# EAGLE design iv4_4lw_1.2.1usb (EAGLE 5.06)
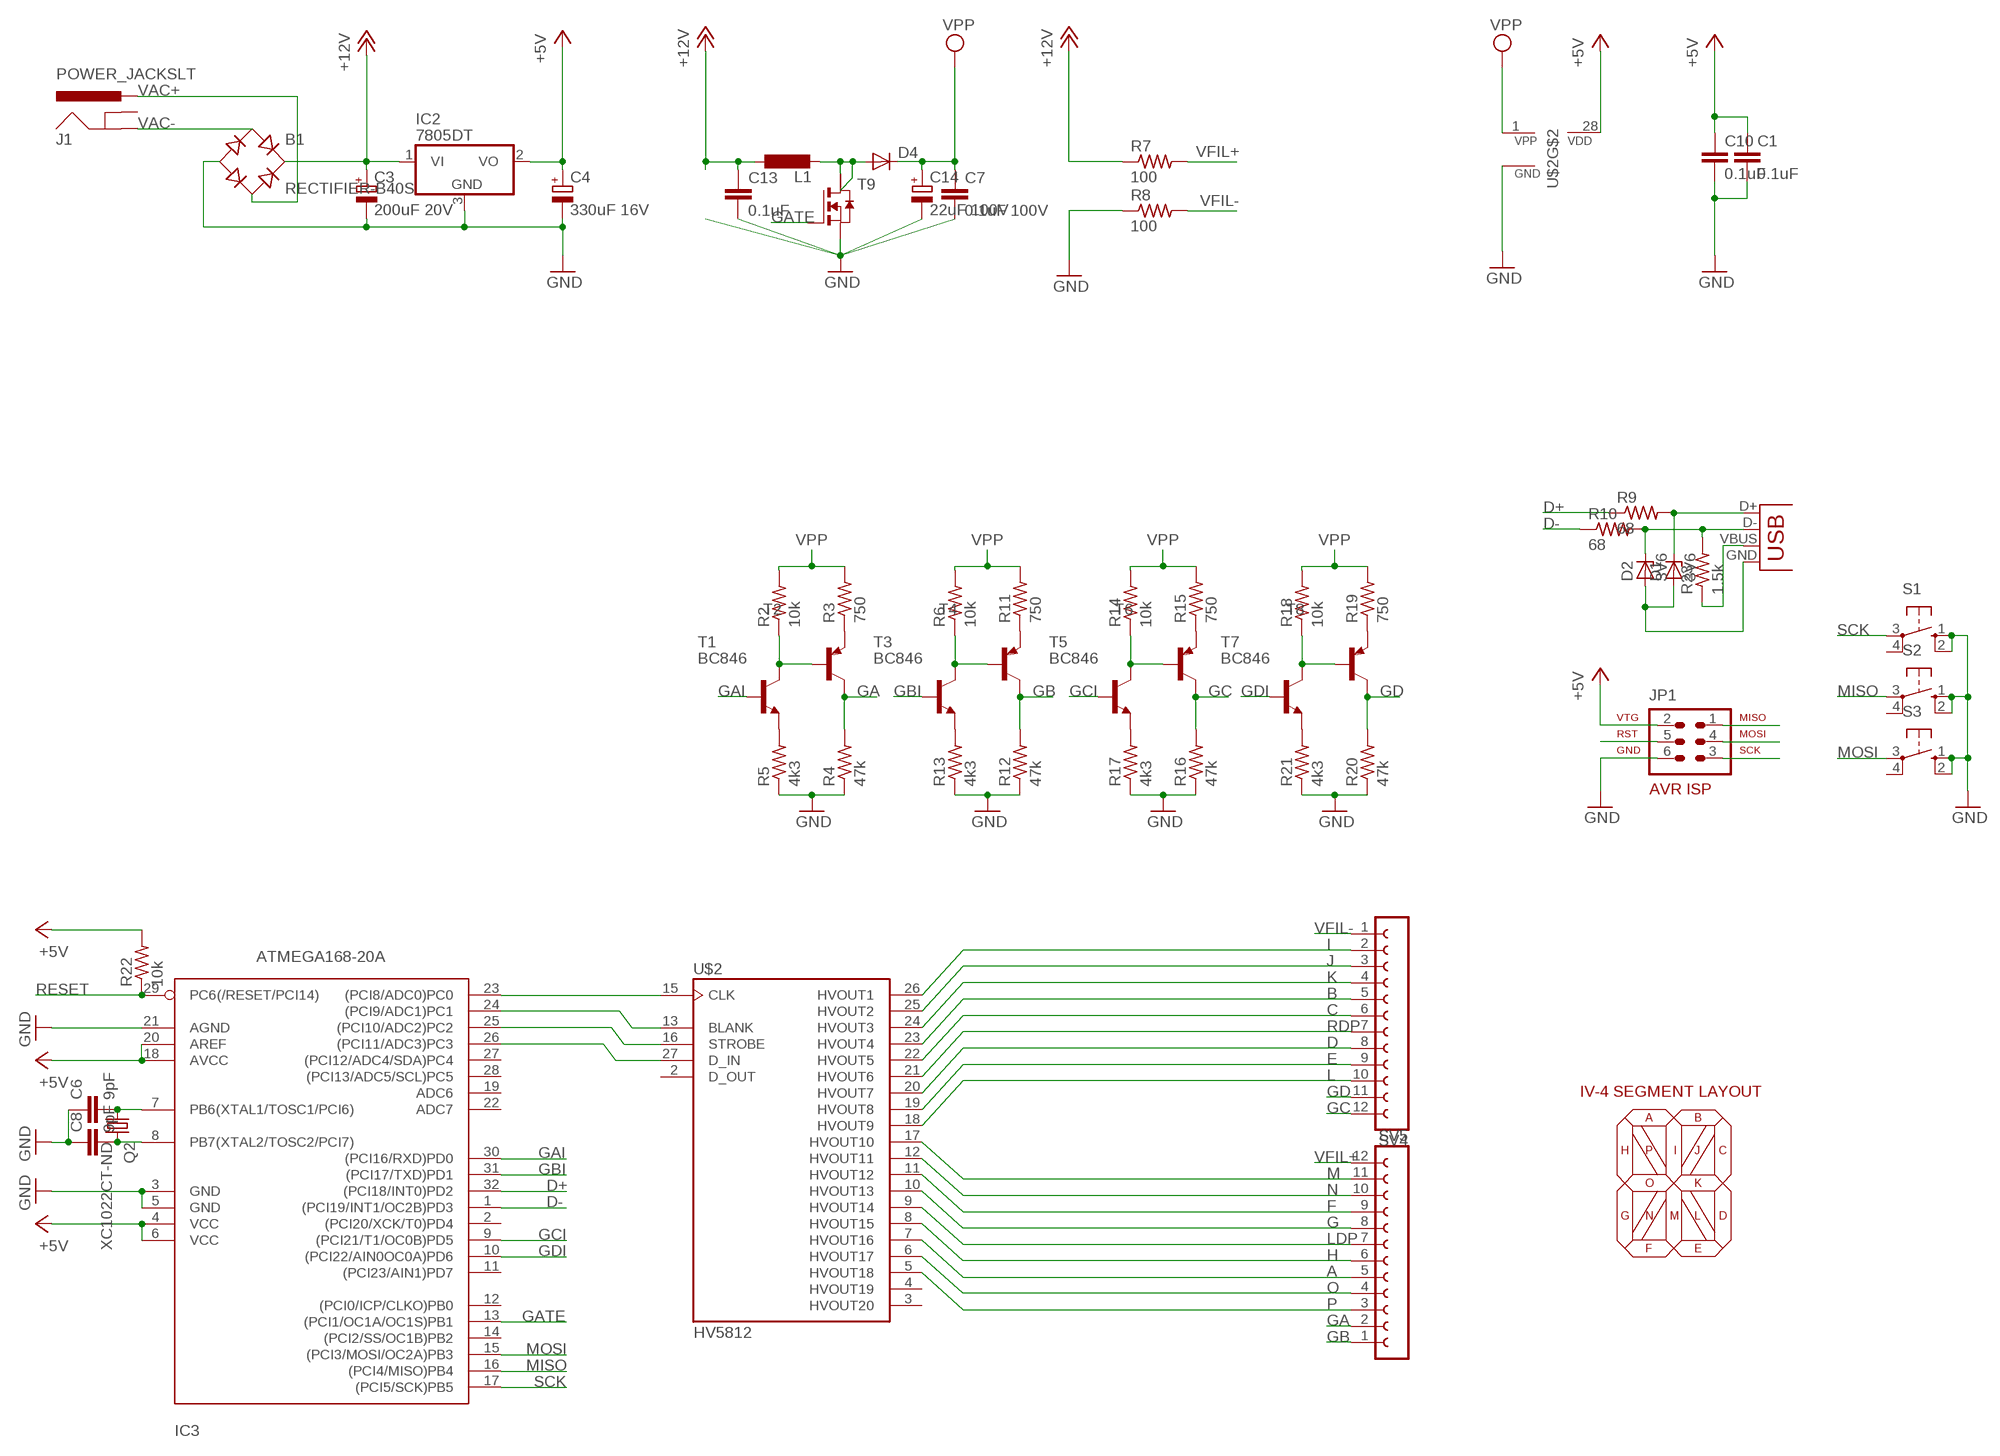
[diagram p0: schematic, sheet 1]

## Parts
B1  RECTIFIER-B40S  [B40S]
C1  0.1uF  C-EUC0805  [C0805]
C3  200uF 20V  CPOL-EUE2.5-7  [E2,5-7]
C4  330uF 16V  CPOL-EUE2.5-7  [E2,5-7]
C6  9pF  C-EUC0805  [C0805]
C7  0.1uF 100V  C-EUC1206  [C1206]
C8  9pF  C-EUC0805  [C0805]
C10  0.1uF  C-EUC0805  [C0805]
C13  0.1uF  C-EUC0805  [C0805]
C14  22uF 100V  CPOL-EUE2.5-7  [E2,5-7]
D1  3V6  ZENER-DIODESOD80C  [SOD80C]
D2  3V6  ZENER-DIODESOD80C  [SOD80C]
D4  DIODE-DO214AC  [DO214AC]
IC2  7805DT  [TO252]
IC3  ATMEGA168-20A  [TQFP32-08]
J1  POWER_JACKSLT  [POWER_JACK_SLOT]
JP1  AVR-ISP-6  [AVR-ISP-6]
L1  DO3316P  [DO3316P]
Q2  XC1022CT-ND  CRYSTALCTS406  [CTS406]
R2  10k  R-US_R0805  [R0805]
R3  750  R-US_R0805  [R0805]
R4  47k  R-US_R0805  [R0805]
R5  4k3  R-US_R0805  [R0805]
R6  10k  R-US_R0805  [R0805]
R7  100  R-US_0207/7  [0207/7]
R8  100  R-US_0207/7  [0207/7]
R9  68  R-US_R0805  [R0805]
R10  68  R-US_R0805  [R0805]
R11  750  R-US_R0805  [R0805]
R12  47k  R-US_R0805  [R0805]
R13  4k3  R-US_R0805  [R0805]
R14  10k  R-US_R0805  [R0805]
R15  750  R-US_R0805  [R0805]
R16  47k  R-US_R0805  [R0805]
R17  4k3  R-US_R0805  [R0805]
R18  10k  R-US_R0805  [R0805]
R19  750  R-US_R0805  [R0805]
R20  47k  R-US_R0805  [R0805]
R21  4k3  R-US_R0805  [R0805]
R22  10k  R-US_R0805  [R0805]
R23  1.5k  R-US_R0805  [R0805]
S1  10-XX  [B3F-10XX]
S2  10-XX  [B3F-10XX]
S3  10-XX  [B3F-10XX]
SV4  FE12-1  [FE12]
SV5  FE12-1  [FE12]
T1  BC846  [SOT23]
T2  BC856A-PNP-SOT23-BEC  [SOT23-BEC]
T3  BC846  [SOT23]
T4  BC856A-PNP-SOT23-BEC  [SOT23-BEC]
T5  BC846  [SOT23]
T6  BC856A-PNP-SOT23-BEC  [SOT23-BEC]
T7  BC846  [SOT23]
T8  BC856A-PNP-SOT23-BEC  [SOT23-BEC]
T9  NMOSSOT223  [SOT223]
U$2  HV5812  [SO28W]
X1  USBSMD  [USB-MINIB]

## Nets
+5V: C1.1 C4.+ C10.1 IC2.2(VO) IC3.4(VCC) IC3.6(VCC) IC3.18(AVCC) IC3.20(AREF) JP1.2 R22.2 U$2.28(VDD)
+12V: B1.+ C3.+ C13.1 IC2.1(VI) L1.2 R7.1
A: SV5.5 U$2.7(HVOUT16)
B: SV4.5 U$2.23(HVOUT4)
BLANK: IC3.24((PCI9/ADC1)PC1) U$2.13(BLANK)
C: SV4.6 U$2.22(HVOUT5)
CLK: IC3.23((PCI8/ADC0)PC0) U$2.15(CLK)
D: SV4.8 U$2.20(HVOUT7)
D+: IC3.32((PCI18/INT0)PD2) R9.1
D-: IC3.1((PCI19/INT1/OC2B)PD3) R10.1
DIN: IC3.26((PCI11/ADC3)PC3) U$2.27(D_IN)
E: SV4.9 U$2.19(HVOUT8)
F: SV5.9 U$2.11(HVOUT12)
G: SV5.8 U$2.10(HVOUT13)
GA: R4.2 SV5.2 T2.C
GAI: IC3.30((PCI16/RXD)PD0) T1.1(B)
GATE: IC3.13((PCI1/OC1A/OC1S)PB1) T9.1(G)
GB: R12.2 SV5.1 T4.C
GBI: IC3.31((PCI17/TXD)PD1) T3.1(B)
GC: R16.2 SV4.12 T6.C
GCI: IC3.9((PCI21/T1/OC0B)PD5) T5.1(B)
GD: R20.2 SV4.11 T8.C
GDI: IC3.10((PCI22/AIN0OC0A)PD6) T7.1(B)
GND: B1.- C1.2 C3.- C4.- C6.1 C7.2 C8.1 C10.2 C13.2 C14.- IC2.3(GND) IC3.3(GND) IC3.5(GND) IC3.21(AGND) JP1.6 R4.1 R5.1 R8.1 R12.1 R13.1 R16.1 R17.1 R20.1 R21.1 S1.1(S) S1.2(S1) S2.1(S) S2.2(S1) S3.1(S) S3.2(S1) T9.3(S) U$2.14(GND)
H: SV5.6 U$2.8(HVOUT15)
I: SV4.2 U$2.26(HVOUT1)
J: SV4.3 U$2.25(HVOUT2)
K: SV4.4 U$2.24(HVOUT3)
L: SV4.10 U$2.18(HVOUT9)
LDP: SV5.7 U$2.9(HVOUT14)
M: SV5.11 U$2.17(HVOUT10)
MISO: IC3.16((PCI4/MISO)PB4) JP1.1 S2.3(P)
MOSI: IC3.15((PCI3/MOSI/OC2A)PB3) JP1.4 S3.3(P)
N: SV5.10 U$2.12(HVOUT11)
N$1: D4.A L1.1 T9.2(D) T9.4(D2)
N$2: C6.2 IC3.7(PB6(XTAL1/TOSC1/PCI6)) Q2.1
N$3: C8.2 IC3.8(PB7(XTAL2/TOSC2/PCI7)) Q2.3
N$4: D2.C R10.2 R23.2 X1.D-
N$5: D1.C R9.2 X1.D+
N$6: R2.1 T1.3(C) T2.B
N$7: R3.1 T2.E
N$8: R5.2 T1.2(E)
N$10: R23.1 X1.VBUS
N$11: D1.A D2.A X1.GND
N$15: R6.1 T3.3(C) T4.B
N$16: R11.1 T4.E
N$17: R13.2 T3.2(E)
N$19: R14.1 T5.3(C) T6.B
N$20: R15.1 T6.E
N$21: R17.2 T5.2(E)
N$23: R18.1 T7.3(C) T8.B
N$24: R19.1 T8.E
N$25: R21.2 T7.2(E)
O: SV5.4 U$2.6(HVOUT17)
P: SV5.3 U$2.5(HVOUT18)
RDP: SV4.7 U$2.21(HVOUT6)
RESET: IC3.29(PC6(/RESET/PCI14)) JP1.5 R22.1
SCK: IC3.17((PCI5/SCK)PB5) JP1.3 S1.3(P)
STROBE: IC3.25((PCI10/ADC2)PC2) U$2.16(STROBE)
VAC+: B1.AC2 J1.PWR
VAC-: B1.AC1 J1.GND@2(GND)
VFIL+: R7.2 SV5.12
VFIL-: R8.2 SV4.1
VPP: C7.1 C14.+ D4.C R2.2 R3.2 R6.2 R11.2 R14.2 R15.2 R18.2 R19.2 U$2.1(VPP)
Unconnected: IC3.2((PCI20/XCK/T0)PD4) IC3.11((PCI23/AIN1)PD7) IC3.12((PCI0/ICP/CLKO)PB0) IC3.14((PCI2/SS/OC1B)PB2) IC3.19(ADC6) IC3.22(ADC7) IC3.27((PCI12/ADC4/SDA)PC4) IC3.28((PCI13/ADC5/SCL)PC5) J1.GND@1(GNDBREAK) S1.4(P1) S2.4(P1) S3.4(P1) U$2.2(D_OUT) U$2.3(HVOUT20) U$2.4(HVOUT19)

## Notes on the sheet
- IV-4 SEGMENT LAYOUT
- A | B
- H | P | I | J | C
- O | K
- G | N | M | L | D
- F | E

## Library data of the parts
B1 = rectifier:RECTIFIER-: Rectifier
C1 C6-C8 C10 C13 = rcl:C-EU: CAPACITOR, European symbol
C3 C4 C14 = rcl:CPOL-EU: POLARIZED CAPACITOR, European symbol
D1 D2 = diode:ZENER-DIODE: Z-Diode
D4 = diode:DIODE-: DIODE
IC2 = linear:78*: Positive VOLTAGE REGULATOR Source: http://cache.national.com/ds/LM/LM78L05.pdf http://www.fairchildsemi.com/ds/LM/LM7805.pdf
IC3 = avr:ATMEGA168: MICROCONTROLLER 16 kBytes FLASH 1 kBytes SRAM 512 Bytes EEPROM USART 8-channel 10 bit ADC
J1 = SparkFun:POWER_JACK: Power Jack This is the standard 5.5mm barrel jack for power. The PTH is the most common, proven, reliable, footprint. All others are experimental. The Slot footprint only works if the mill layer is transmitted to the PCB fab house so be warned. Spark Fun Electronics SKU : PRT-00119. Mating wall wart : TOL-00298 (and others)
JP1 = atmel:AVR-ISP-6: AVR ISP-6 Serial Programming Header
L1 = inductor-coilcraft:DO3316P: COILCRAFT
Q2 = crystal:CRYSTAL: CRYSTAL
R2-R23 = rcl:R-US_: RESISTOR, American symbol
S1-S3 = switch-omron:10-XX: OMRON SWITCH
SV4 SV5 = con-lsta:FE12-1: FEMALE HEADER
T1 T3 T5 T7 = transistor:BC846: NPN TRANSISTOR
T2 T4 T6 T8 = transistor:*-PNP-: PNP Transistror
T9 = zetex:NMOSSOT223: MOS FET
U$2 = supertex-hv:HV5812
X1 = SparkFun:USB: USB Connectors USB-B-PTH is fully proven SKU : PRT-00139 USB-miniB is fully proven SKU : PRT-00587 USB-A-PCB is untested. USB-A-H is throughly reviewed, but untested. Spark Fun Electronics SKU : PRT-00437 USB-B-SMT is throughly reviewed, but untested. Needs silkscreen touching up. USB-A-S has not been used/tested USB-MB-H has not been used/tested

## Board
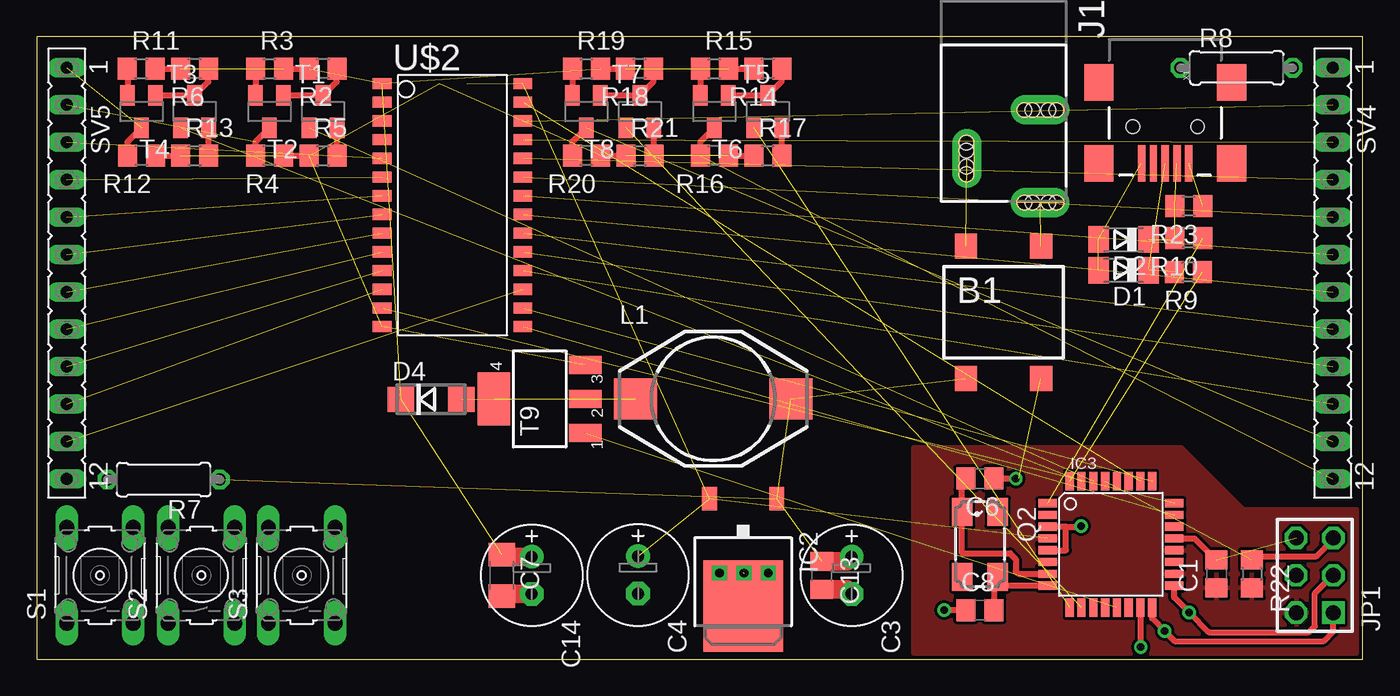
[diagram p1: board, top side]
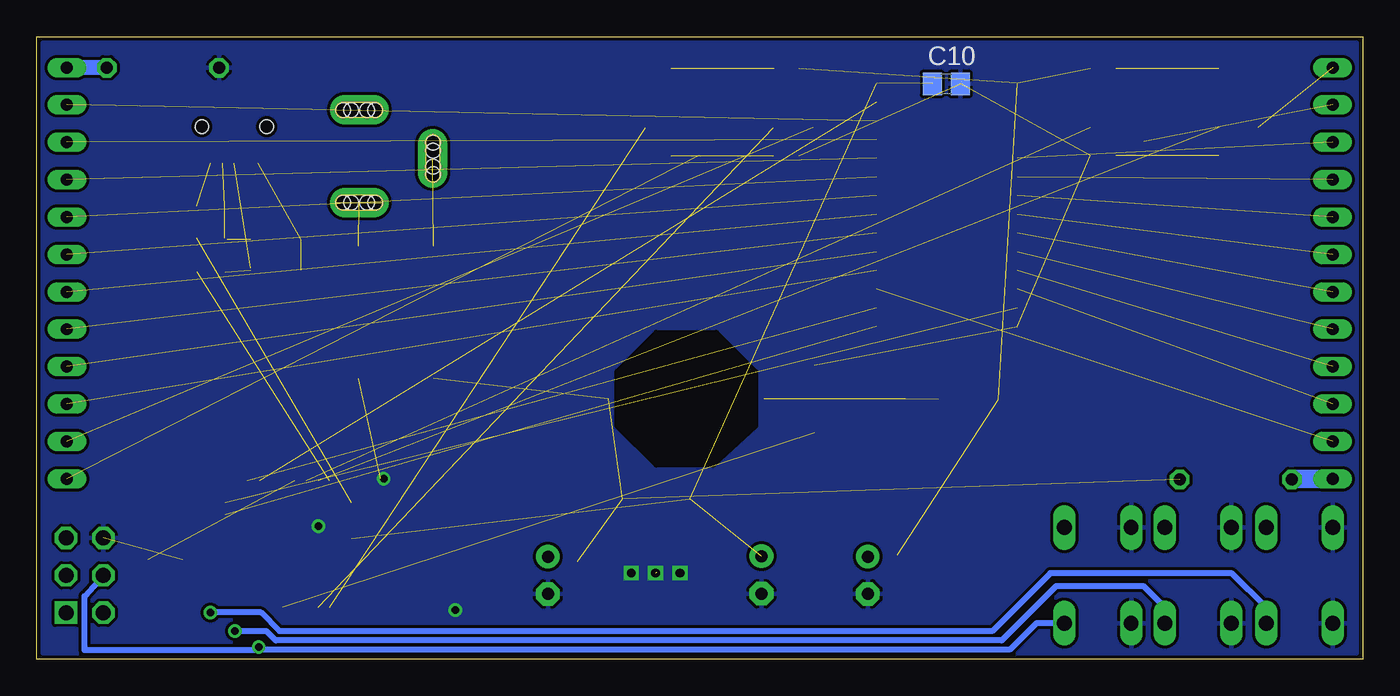
[diagram p2: board, bottom side, seen from below]

Size 90.02 x 42.27 mm. Coordinates in mm from the lower left corner, seen from the top.
Outline: 0,0 90.02,0 90.02,42.27 0,42.27 0,0
Copper layers (1*16): Top 0.035mm / dielectric 1.5mm / Bottom 0.035mm
Design rules "default *": minimum track width 8mil, minimum drill 20mil, track to track 8mil, track to pad 8mil, pad to pad 8mil, via to via 8mil, smd to smd 8mil, copper to edge 10mil, drill to drill 8mil, minimum pad ring 10mil, minimum via ring 8mil, stop-mask expansion 4mil, vias tented up to drill 0mil, thermal gap 8mil
Holes 1 mm at 63.12,32.92 63.12,33.45 63.12,35.08 63.12,34.54 69.22,37.29 68.68,37.29 67.06,37.29 67.59,37.29 69.22,31.01 68.68,31.01 67.06,31.01 67.59,31.01
bRestrict: area 41.2,13.2 to 50.6,22.1

### Footprints (pad centres in the part's own frame; a part is rotated, then mirrored left to right if it is on the bottom)
B40S = smd 1.5 x 1.7: + -2.55,-4.5; - 2.55,-4.5; AC1 -2.55,4.5; AC2 2.55,4.5
C0805 = smd 1.3 x 1.5: 1 -0.95,0; 2 0.95,0
E2,5-7 = drill 0.813 pad 1.6 round: + -1.27,0 | drill 0.813 pad 1.6 octagon: - 1.27,0
C1206 = smd 1.6 x 1.8: 1 -1.4,0; 2 1.4,0
SOD80C = smd 1.4 x 1.8: A 1.7,0; C -1.7,0
DO214AC = smd 1.8 x 1.7: A 2.05,0; C -2.05,0
TO252 = smd 1 x 1.6: 1 -2.28,-4.8; 2 2.28,-4.8 | smd 5.4 x 6.2: 3 0,2.5
TQFP32-08 = smd 1.27 x 0.559: 1 -4.293,2.8; 2 -4.293,2; 3 -4.293,1.2; 4 -4.293,0.4; 5 -4.293,-0.4; 6 -4.293,-1.2; 7 -4.293,-2; 8 -4.293,-2.8; 17 4.293,-2.8; 18 4.293,-2; 19 4.293,-1.2; 20 4.293,-0.4; 21 4.293,0.4; 22 4.293,1.2; 23 4.293,2; 24 4.293,2.8 | smd 0.559 x 1.27: 9 -2.8,-4.293; 10 -2,-4.293; 11 -1.2,-4.293; 12 -0.4,-4.293; 13 0.4,-4.293; 14 1.2,-4.293; 15 2,-4.293; 16 2.8,-4.293; 25 2.8,4.293; 26 2,4.293; 27 1.2,4.293; 28 0.4,4.293; 29 -0.4,4.293; 30 -1.2,4.293; 31 -2,4.293; 32 -2.8,4.293
POWER_JACK_SLOT = drill 1 pad 2 long: GND@1 2.58,7.5; GND@2 7.58,10.8; PWR 2.58,13.8
AVR-ISP-6 = drill 1.016 square: 1 -2.54,-1.27 | drill 1.016 octagon: 2 -2.54,1.27; 3 0,-1.27; 4 0,1.27; 5 2.54,-1.27; 6 2.54,1.27
DO3316P = smd 2.92 x 2.79: 1 -5.28,0; 2 5.28,0
CTS406 = smd 1.9 x 1.4: 1 -2.2,-1.2; 2 2.2,-1.2; 3 2.2,1.2; 4 -2.2,1.2
R0805 = smd 1.3 x 1.5: 1 -0.95,0; 2 0.95,0
0207/7 = drill 0.813 octagon: 1 -3.81,0; 2 3.81,0
B3F-10XX = drill 1.016 long: 1 -3.251,2.261; 2 3.251,2.261; 3 -3.251,-2.261; 4 3.251,-2.261
FE12 = drill 0.813 long: 1 -13.97,0; 2 -11.43,0; 3 -8.89,0; 4 -6.35,0; 5 -3.81,0; 6 -1.27,0; 7 1.27,0; 8 3.81,0; 9 6.35,0; 10 8.89,0; 11 11.43,0; 12 13.97,0
SOT23 = smd 1 x 1.4: 1 -0.95,-1.1; 2 0.95,-1.1; 3 0,1.1
SOT23-BEC = smd 1 x 1.4: B -0.95,-1.1; C 0,1.1; E 0.95,-1.1
SOT223 = smd 1.219 x 2.235: 1 -2.311,-3.099; 2 0,-3.099; 3 2.311,-3.099 | smd 3.6 x 2.2: 4 0,3.099
SO28W = smd 0.762 x 1.27: 1 -8.89,-4.78; 2 -7.62,-4.78; 3 -6.35,-4.78; 4 -5.08,-4.78; 5 -3.81,-4.78; 6 -2.54,-4.78; 7 -1.27,-4.78; 8 0,-4.78; 9 1.27,-4.78; 10 2.54,-4.78; 11 3.81,-4.78; 12 5.08,-4.78; 13 6.35,-4.78; 14 7.62,-4.78; 15 7.62,4.78; 16 6.35,4.78; 17 5.08,4.78; 18 3.81,4.78; 19 2.54,4.78; 20 1.27,4.78; 21 0,4.78; 22 -1.27,4.78; 23 -2.54,4.78; 24 -3.81,4.78; 25 -5.08,4.78; 26 -6.35,4.78; 27 -7.62,4.78; 28 -8.89,4.78
USB-MINIB = smd 2.5 x 0.5: D+ 2.5,0; D- 2.5,0.8; GND 2.5,-1.6; ID 2.5,-0.8; VBUS 2.5,1.6 | smd 2.5 x 2: GND@1 -3,-4.5; GND@2 -3,4.5; GND@3 2.5,4.5; GND@4 2.5,-4.5 | hole 0.9: 0,2.2; 0,-2.2

### Placement (x,y rotation side)
B1  65.63,23.55 0 top
C1  80.09,5.79 90 top
C3  55.32,5.69 270 top
C4  40.82,5.72 270 top
C6  64.03,12.27 180 top
C7  31.57,5.69 270 top
C8  64.03,3.33 0 top
C10  28.27,39.07 0 bottom
C13  53.29,5.69 270 top
C14  33.6,5.69 270 top
D1  73.79,26.42 180 top
D2  73.79,28.5 180 top
D4  26.77,17.63 0 top
IC2  47.96,6.1 180 top
IC3  72.92,7.8 0 top
J1  70.71,44.81 180 top
JP1  86.77,5.69 90 top
L1  45.92,17.68 0 top
Q2  64.03,7.8 270 top
R2  19.43,40.11 180 top
R3  15.8,40.11 0 top
R4  15.8,34.19 180 top
R5  19.43,34.19 0 top
R6  10.72,40.11 180 top
R7  8.61,12.19 180 top
R8  81.46,40.16 0 top
R9  78.18,26.29 180 top
R10  78.21,28.59 180 top
R11  7.09,40.11 0 top
R12  7.11,34.19 180 top
R13  10.72,34.19 0 top
R14  49.63,40.11 180 top
R15  46,40.11 0 top
R16  46,34.19 180 top
R17  49.63,34.19 0 top
R18  40.92,40.11 180 top
R19  37.31,40.11 0 top
R20  37.31,34.19 180 top
R21  40.95,34.19 0 top
R22  82.5,5.79 270 top
R23  78.21,30.76 180 top
S1  4.29,5.69 90 top
S2  11.18,5.69 90 top
S3  17.98,5.69 90 top
SV4  87.99,26.21 270 top
SV5  2.03,26.21 270 top
T1  19.43,37.19 0 top
T2  15.8,37.19 180 top
T3  10.72,37.19 0 top
T4  7.11,37.19 180 top
T5  49.63,37.19 0 top
T6  46,37.19 180 top
T7  40.95,37.19 0 top
T8  37.31,37.19 180 top
T9  34.14,17.68 90 top
U$2  28.22,30.2 270 top
X1  76.61,36.17 270 top

### Tracks (layer width: path | path; a pad name or v marks a point on that pad's centre or on a via)
+5V  (4 unrouted)
  Top 0.406: 33.02,39.11 U$2.28 32.97,39.12
  pour Top: 59.51,0.41 89.61,0.41 89.61,10.16 81.92,10.16 77.7,14.38 59.51,14.38
+12V  (4 unrouted)
  Top 1.27: C13.1 55,6.64 C3.+
A  (1 unrouted)
B  (1 unrouted)
BLANK  (1 unrouted)
C  (1 unrouted)
CLK  (1 unrouted)
D  (1 unrouted)
D+  (1 unrouted)
D-  (1 unrouted)
DIN  (1 unrouted)
E  (1 unrouted)
F  (1 unrouted)
G  (1 unrouted)
GA  (1 unrouted)
  Top 0.406: R4.2 14.85,35.14 T2.C
GAI  (1 unrouted)
GATE  (1 unrouted)
GB  (1 unrouted)
  Top 0.406: T4.C 6.16,35.14 R12.2
GBI  (1 unrouted)
GC  (1 unrouted)
  Top 0.406: R16.2 45.05,35.14 T6.C
GCI  (1 unrouted)
GD  (1 unrouted)
  Top 0.406: R20.2 36.36,35.14 T8.C
GDI  (1 unrouted)
GND  (via drill 0.51, 0.6)  (9 unrouted)
  Top 0.406: C1.2 79.49,7.31 78.6,8.2 IC3.21 | C6.1 v66.47,12.27 | 69.88,9 IC3.3 | 69.88,9 70.89,9 v70.89,9.02 | IC3.5 69.88,7.4 69.88,9 | C8.1 v61.6,3.33 | R12.1 R13.1 | R4.1 R5.1 | R16.1 R17.1 | R20.1 R21.1
  Top 0.813: C1.2 80.12,6.76
  Top 1.27: C3.- 55,4.74 C13.2 | IC2.3 47.96,5.89 | C14.- 31.7,4.42 C7.2
  Bottom 0.406: v66.47,12.27 66.68,12.27
  other vias: 46.36,5.84 48.01,5.84 49.66,5.84
  pour Bottom: 89.61,0.41 0.41,0.41 0.41,41.86 89.61,41.86
H  (1 unrouted)
I  (1 unrouted)
J  (1 unrouted)
K  (1 unrouted)
L  (1 unrouted)
LDP  (1 unrouted)
M  (1 unrouted)
MISO  (via drill 0.51 pad 0.2)
  Top 0.406: JP1.1 88.04,1.88 87.38,1.22 77.27,1.22 v76.58,1.91 75.72,2.76 IC3.16
  Bottom 0.406: S2.3 13.44,3.53 14.86,4.95 20.83,4.95 24.51,1.27 73.79,1.27 74.42,1.91 v76.58,1.91
MOSI  (via drill 0.51)
  Top 0.406: v74.96,0.81 74.96,2.65 IC3.15
  Bottom 0.406: JP1.4 85.5,5.64 86.77,4.27 86.77,0.61 74.96,0.61 v74.96,0.81 74.78,0.64 23.95,0.64 22.15,2.44 S3.3
N  (1 unrouted)
N$1  (3 unrouted)
N$2
  Top 0.406: C6.2 62.88,11.86 62.81,11.86 62.81,10.03 Q2.1 62.81,9.98 62.81,7.19 66.07,7.19 66.47,6.78 66.47,5.97 66.64,5.8 IC3.7
N$3
  Top 0.406: 64.85,5.77 Q2.3 65.03,5 | 65.03,5 IC3.8 | C8.2 65.03,3.33 65.03,5
N$4  (3 unrouted)
  Top 0.406: D2.C 75.49,28.47 | R10.2 77.08,28.5
N$5  (2 unrouted)
  Top 0.406: X1.D+ 76.58,33.67 | D1.C 75.49,26.54
N$6
  Top 0.406: R2.1 20.36,39.21 T1.3 T2.B
N$7
  Top 0.406: R3.1 T2.E
  Top 0.61: R3.1 14.78,40.11
N$8
  Top 0.406: R5.2 T1.2
N$10  (1 unrouted)
N$11  (2 unrouted)
  Top 0.406: X1.GND 74.99,33.66
N$15
  Top 0.406: R6.1 11.64,39.21 T3.3 T4.B
N$16
  Top 0.406: R11.1 6.16,40.11 T4.E
N$17
  Top 0.406: R13.2 T3.2
N$19
  Top 0.406: R14.1 50.58,39.24 T5.3 T6.B
N$20
  Top 0.406: R15.1 T6.E
N$21
  Top 0.406: R17.2 T5.2
N$23
  Top 0.406: R18.1 41.87,39.21 T7.3 T8.B
N$24
  Top 0.406: R19.1 T8.E
N$25
  Top 0.406: R21.2 T7.2
O  (1 unrouted)
P  (1 unrouted)
RDP  (1 unrouted)
RESET  (1 unrouted)
  Top 0.406: JP1.5 88.04,8.15 86.87,6.99 82.85,6.99 R22.1
SCK  (via drill 0.51 pad 0.2)
  Top 0.406: JP1.3 87.99,5.69 86.77,4.47 86.77,2.24 86.36,1.83 79.58,1.83 v78.23,3.18 77.22,4.19 IC3.17 | IC3.17 76.78,4.97 | IC3.17 77.03,5
  Bottom 0.406: S1.3 6.55,3.51 8.89,5.84 21.21,5.84 25.15,1.91 73.53,1.91 74.8,3.18 v78.23,3.18
STROBE  (1 unrouted)
VAC+  (1 unrouted)
VAC-  (1 unrouted)
VFIL+
  Bottom 1.27: R7.2 4.5,12.24 SV5.12
VFIL-
  Bottom 1.016: R8.2 85.42,40.18 SV4.1
VPP  (6 unrouted)
  Top 0.406: U$2.1 23.41,39.12 | R11.2 R6.2 | R3.2 R2.2 | R15.2 R14.2 | R19.2 R18.2
  Top 0.61: U$2.1 23.47,39.12
  Top 1.27: C14.+ 31.7,6.96 C7.1